# Altium project Learning_Platform.PrjPcb (part 4 of 4)

## Sheet Safety.SchDoc: <Project Name>
size A3; ApprovedBy: <Appr.>; Author: <Author>; CompanyName: Infineon Technologies AG; Engineer: <Rel.>; Organization: Infineon Technologies AG; Address1: IFAG DES S PS; Address2: Am Campeon 1-12  -  85579 Neubiberg  -  Germany; Address3: 85579 Neubiberg; Address4: Germany; DocumentNumber: 6; Revision: <Rev.>; SheetNumber: 6; SheetTotal: 9; Release: RC00; PageSetup: Record=PageOptions|CenterHorizontal=True|CenterVertical=True|PrintScale=1.01|XCorrection=1.00|YCorrection=1.00|PrintKind=0|BorderSize=5000000|LeftOffset=0|BottomOffset=0|Orientation=2|PaperLength=1000|PaperWidth=1000|Scale=100|PaperSource=7|PrintQuality=-4|MediaType=1|DitherType=10|PaperKind=A3|PrintScaleMode=1; Doc_ConfidentialStatus: <Doc_ConfidentialStatus>; Doc_Preliminary: <Doc_Preliminary>
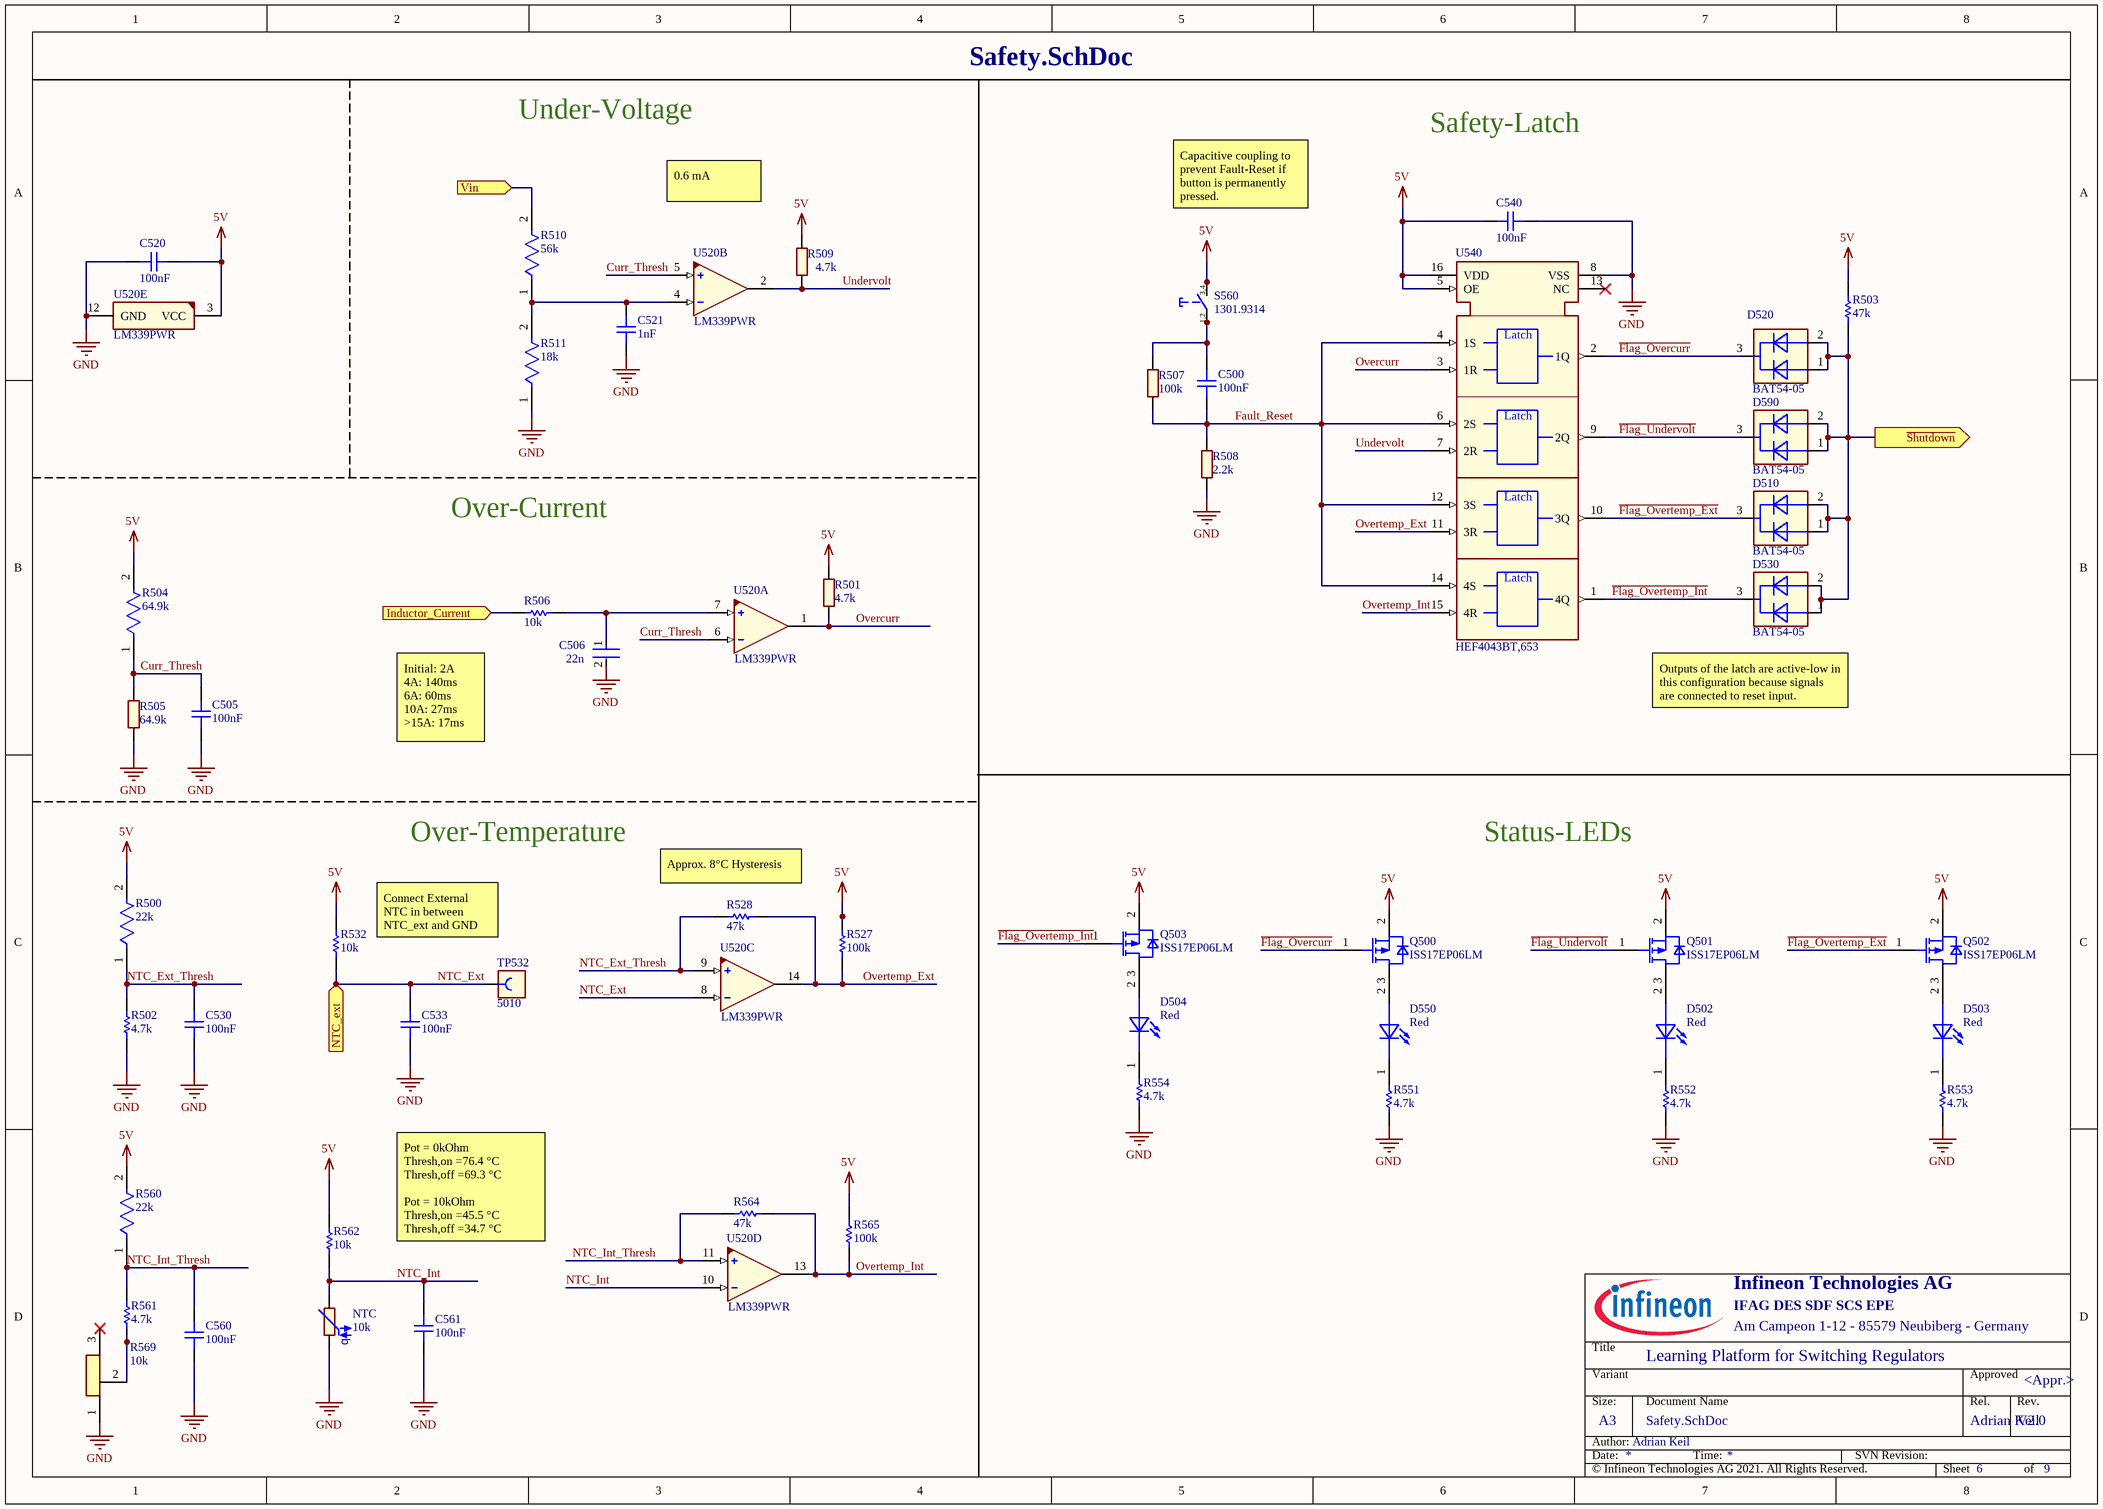
[diagram p4: Safety.SchDoc]

### Parts
C500  100nF  [CAPC3216X125N-0]
C505  100nF  [CAPC3216X125N-0]
C506  22n  [FP-GRM319-0_15-IPC_C]
C520  100nF  [CAPC3216X125N-0]
C521  1nF  [CAPC3216X95N]
C530  100nF  [CAPC3216X125N-0]
C533  100nF  [CAPC3216X125N-0]
C540  100nF  [CAPC3216X125N-0]
C560  100nF  [CAPC3216X125N-0]
C561  100nF  [CAPC3216X125N-0]
D502  Red  [LEDSC160X80X80-2N-1]
D503  Red  [LEDSC160X80X80-2N-1]
D504  Red  [LEDSC160X80X80-2N-1]
D510  BAT54-05  [SOT95P240X110-3N-1-V]
D520  BAT54-05  [SOT95P240X110-3N-1-V]
D530  BAT54-05  [SOT95P240X110-3N-1-V]
D550  Red  [LEDSC160X80X80-2N-1]
D590  BAT54-05  [SOT95P240X110-3N-1-V]
NTC  10k  [RESC1608X95N-1]
Q500  ISS17EP06LM  [SOT95P240X110-3N-1-V]
Q501  ISS17EP06LM  [SOT95P240X110-3N-1-V]
Q502  ISS17EP06LM  [SOT95P240X110-3N-1-V]
Q503  ISS17EP06LM  [SOT95P240X110-3N-1-V]
R500  22k  [FP-CRCW1206-e3-IPC_A]
R501  4.7k  [RESC3216X60N]
R502  4.7k  [RESC3216X60X45ML15T20]
R503  47k  [RESC3216X60X45LL10T20]
R504  64.9k  [FP-CRCW1206-e3-IPC_C]
R505  64.9k  [RESC3216X60N]
R506  10k  [RESC3116X65X50NL20T20]
R507  100k  [RESC3216X60N]
R508  2.2k  [RESC3216X60N]
R509  4.7k  [RESC3216X60N]
R510  56k  [FP-CRCW1206-e3-IPC_C]
R511  18k  [FP-CRCW1206-e3-IPC_C]
R527  100k  [RESC3216X60X45NL10T20]
R528  47k  [RESC3216X60X45LL10T20]
R532  10k  [RESC3116X65X50NL20T20]
R551  4.7k  [RESC3216X60X45ML15T20]
R552  4.7k  [RESC3216X60X45ML15T20]
R553  4.7k  [RESC3216X60X45ML15T20]
R554  4.7k  [RESC3216X60X45ML15T20]
R560  22k  [FP-CRCW1206-e3-IPC_A]
R561  4.7k  [RESC3216X60X45ML15T20]
R562  10k  [RESC3116X65X50NL20T20]
R564  47k  [RESC3216X60X45LL10T20]
R565  100k  [RESC3216X60X45NL10T20]
R569  10k  [3361P1103GLF]
S560  1301.9314  [SW-SMD-1301.9314]
TP532  5010  [CON-THT-TP-5010]
U520  LM339PWR  [SOP65P640X120-14N-1]  (parts A,B,C,D,E of 5)
U540  HEF4043BT,653  [SOIC127P600X175-16N-6]

### Ports
Inductor_Current (in), NTC_ext (in), Vin (in), ~{Shutdown} (out)

### Nets
5V: C520.1 C540.2 Q500.2(SOURCE) Q501.2(SOURCE) Q502.2(SOURCE) Q503.2(SOURCE) R500.2 R501.2 R503.2 R504.2 R509.2 R527.2 R532.2 R560.2 R562.2 R565.2 S560.3 S560.4 U520.3(VCC) U540.5(OE) U540.16(VDD)
GND: C505.1 C506.2 C520.2 C521.1 C530.1 C533.1 C540.1 C560.1 C561.1 NTC.1 R502.1 R505.1 R508.2 R511.1 R551.1 R552.1 R553.1 R554.1 R569.1(CCW) U520.12(GND) U540.8(VSS)
~{Flag_Overcurr}: D520.3(CATHODE) Q500.1(GATE) U540.2(1Q)
~{Flag_Overtemp_Ext}: D510.3(CATHODE) Q502.1(GATE) U540.10(3Q)
~{Flag_Overtemp_Int}: D530.3(CATHODE) Q503.1(GATE) U540.1(4Q)
~{Flag_Undervolt}: D590.3(CATHODE) Q501.1(GATE) U540.9(2Q)
~{Shutdown}: D510.1(ANODE_1) D510.2(ANODE_2) D520.1(ANODE_1) D520.2(ANODE_2) D530.1(ANODE_1) D530.2(ANODE_2) D590.1(ANODE_1) D590.2(ANODE_2) R503.1 ; port ~{Shutdown}
Curr_Thresh: C505.2 R504.1 R505.2 U520.5(2IN_P) U520.6(1IN_N)
Fault_Reset: C500.2 R507.1 R508.1 U540.4(1S) U540.6(2S) U540.12(3S) U540.14(4S)
Inductor_Current: R506.1 ; port Inductor_Current
NTC_ext: C533.2 R532.1 TP532.1 U520.8(3IN_N) ; port NTC_ext
NTC_Ext_Thresh: C530.2 R500.1 R502.2 R528.1 U520.9(3IN_P)
NTC_Int: C561.2 NTC.2 R562.1 U520.10(4IN_N)
NTC_Int_Thresh: C560.2 R560.1 R561.2 R564.1 U520.11(4IN_P)
Overcurr: R501.1 U520.1(1OUT) U540.3(1R)
Overtemp_Ext: R527.1 R528.2 U520.14(3OUT) U540.11(3R)
Overtemp_Int: R564.2 R565.1 U520.13(4OUT) U540.15(4R)
Undervolt: R509.1 U520.2(2OUT) U540.7(2R)
Vin: R510.2 ; port Vin
NetC500_1: C500.1 R507.2 S560.1 S560.2
NetC506_1: C506.1 R506.2 U520.7(1IN_P)
NetC521_2: C521.2 R510.1 R511.2 U520.4(2IN_N)
NetD502_1: D502.1(Cathode) R552.2
NetD502_2: D502.2(Anode) Q501.3(DRAIN)
NetD503_1: D503.1(Cathode) R553.2
NetD503_2: D503.2(Anode) Q502.3(DRAIN)
NetD504_1: D504.1(Cathode) R554.2
NetD504_2: D504.2(Anode) Q503.3(DRAIN)
NetD550_1: D550.1(Cathode) R551.2
NetD550_2: D550.2(Anode) Q500.3(DRAIN)
NetR561_1: R561.1 R569.2(WIPER_)

Not connected (* = marked no-connect by the designer): R569 3(CW)*; U540 13(NC)*

### Notes on the sheet
- Under-Voltage
- Safety-Latch
- 0.6 mA
- Capacitive coupling to prevent Fault-Reset if button is permanently pressed.
- Over-Current
- (near D530) Outputs of the latch are active-low in this configuration because signals  are connected to reset input.
- Initial: 2A
  4A: 140ms
  6A: 60ms
  10A: 27ms
  >15A: 17ms
- Over-Temperature
- Status-LEDs
- (near R528) Approx. 8°C Hysteresis
- Connect External NTC in between NTC_ext and GND
- Pot = 0kOhm
  Thresh,on =76.4 °C
  Thresh,off =69.3 °C
  Pot = 10kOhm
  Thresh,on =45.5 °C
  Thresh,off =34.7 °C
- Title
- Variant
- Approved
- Date:
- Author:
- Size:
- A3
- Document Name
- Time:
- SVN Revision:
- Rel.
- Rev.
- Sheet
- of
- (in symbol 380147) 3,4; 1,2
- (in symbol 466242) q
- (in symbol 648079) Latch

### Library data of the parts
C500 C505 C520 C530 C533 C540 C560 C561 = 282874: CAP / CERA / 100nF / 50V / 10% / X7R (EIA) / -55°C to 125°C / 1206(3216) / SMD / -; Multiple Parts: No; Legacy PartNumber: CAP01005660; Manufacturer: MuRata; Manufacturer Order Number: GRM31MR71H104KA01; Symbol Type: Capacitor; Single; Standard; 2 Pins; Alternate View: Yes; Article Number: 282874; Version Number: V01; Combined Parameters: TC:X7R (EIA);Tol.:-10%/+10%;Vdc:50V; QuickPick: 100nF / 50V / 10% / X7R (EIA) / 1206 (3216); Type: Standard; Style: Single; Package Metric: 3216; Package Imperial: 1206; ComponentStatus: Released; PLMStatus: Obsolete; Legacy DeviceID: CAP01005660; Part Type: Capacitor; Value: 100nF; Tolerance Neg: 10%; Tolerance Pos: 10%; Application: Standard; Technology: Ceramic; Temperature min: -55; Temperature max: 125; Temperature Range: Military; ROHS Compliant: Y; Automotive Qualified: No; PackageReference: 1206 (3216); ComponentLink1Description: Vendor WebSite; ComponentLink1URL: http://www.murata.com/; ComponentLink2Description: Datasheet; ComponentLink2URL: http://webnetprod.muc.infineon.com/PCBPortal_Prod/WorkFlows/AltiumComponent/StandardDocumentation?Versionid=282875; Supplier 1: Farnell; Supplier 2: DigiKey; Supplier 3: Mouser; Second Source allowed: Yes; Voltage DC (max): 50V; Package Description: Capacitor,non-polarized,Chip;3.20mm L X 1.60mm W X 1.25mm H
C506 = CMP-1037-03764-2: Chip Multilayer Ceramic Capacitors for General Purpose, 1206, 22000pF, C0G, 30ppm/°C, 5%, 50V; MPN: GRM3195C1H223JA01D; Value: 22nF; Insulation Resistance: 10GR; Dielectric: C0G; Dielectric Material: Ceramic; Termination: SMD/SMT; Voltage Rating: 50V; Width: 0.063inch; Number of Pins: 2; Mount: Surface Mount; REACH SVHC: No SVHC; Series: GRM; Voltage: 50V; Length: 3.2mm; Thickness: 0.037inch; Radiation Hardening: No; Case/Package: 1206; Case Code (Metric): 3216; Min Operating Temperature: -55°C; Package Quantity: 4000; Lead Free: Lead Free; Voltage Rating (DC): 50V; Height: 0.85mm; Depth: 1.6mm; Max Operating Temperature: 125°C; Packaging: Tape and Reel; Tolerance: 5%; Construction: Flat; Material: Ceramic; Temperature Coefficient: 30ppm/°C; Case Code (Imperial): 1206; LCSC Part #: C97929
C521 = 280698: CAP / CERA / 1nF / 50V / 10% / X7R (EIA) / -55°C to 125°C / 1206(3216) / SMD / -; Multiple Parts: No; Legacy PartNumber: CAP01005183; Manufacturer: MuRata; Manufacturer Order Number: GRM319R71H102KA01; Symbol Type: Capacitor; Single; Standard; 2 Pins; Alternate View: Yes; Article Number: 280698; Version Number: V01; Combined Parameters: TC:X7R (EIA);Tol.:-10%/+10%;Vdc:50V; QuickPick: 1nF / 50V / 10% / X7R (EIA) / 1206 (3216); Type: Standard; Style: Single; Package Metric: 3216; Package Imperial: 1206; ComponentStatus: Released; PLMStatus: Obsolete; Legacy DeviceID: CAP01005183; Part Type: Capacitor; Value: 1nF; Tolerance Neg: 10%; Tolerance Pos: 10%; Application: Standard; Technology: Ceramic; Temperature min: -55; Temperature max: 125; Temperature Range: Military; ROHS Compliant: Y; Automotive Qualified: No; PackageReference: 1206 (3216); ComponentLink1Description: Vendor WebSite; ComponentLink1URL: http://www.murata.com/; ComponentLink2Description: Datasheet; ComponentLink2URL: http://webnetprod.muc.infineon.com/PCBPortal_Prod/WorkFlows/AltiumComponent/StandardDocumentation?Versionid=280699; Supplier 1: Farnell; Supplier 2: DigiKey; Supplier 3: Mouser; Second Source allowed: Yes; Voltage DC (max): 50V; Package Description: Capacitor,non-polarized,Chip;3.20mm L X 1.60mm W X 0.95mm H
D502-D504 D550 = 625459: WL-SMCW SMT Mono-color Chip LED Waterclear, Red,630nm; Manufacturer: Wurth Elektronik; Manufacturer Order Number: 150060RS75000; Symbol Type: Standard LED Symbol, 1 Cathode, 2 Anode; Article Number: 625459; Version Number: V01; Combined Parameters: Vf:2.4V;If:30mA;Ur:5V;Ir:10uA;Pmax:72mW; QuickPick: LED / 1608 (0603); Style: Single; Automotive Qualified: No; ComponentStatus: Released; PLMStatus: Active; Second Source allowed: Yes; Voltage DC (max): na; Part Type: Diode; Value: Red; Type: LED; Application: Standard; Temperature min: -40; Temperature max: 85; Temperature Range: Industrial; ROHS Compliant: Y; PackageReference: 1608 (0603); ComponentLink1Description: Vendor WebSite; ComponentLink1URL: http://www.we-online.com; ComponentLink2Description: Datasheet; ComponentLink2URL: http://webnetprod.muc.infineon.com/PCBPortal_Prod/WorkFlows/AltiumComponent/StandardDocumentation?Versionid=625460; Supplier 1: Farnell; Supplier Part Number 1: 2322071; Supplier 2: DigiKey; Supplier Part Number 2: 732-4978-1-ND; Supplier 3: Mouser; Supplier Part Number 3: 710-150060RS75000; Package Description: LED,Side Concave; 2 pin,1.60mm W X 0.80mm L X 0.80mm H
D510 = 430837: Silicon Schottky Diode, LS(nH) 1.8, VR 30V; Legacy PartNumber: IFX01401370; Manufacturer: Infineon Technologies; MPN: BAT5405E6327HTSA1; Symbol type: Dual Diode Symbol 3 Pins, 1 Anode, 2 Anode, 3 Cathode; Article Number: 430837; Version Number: V01; Combined Parameters: Vf:800mV;If:200mA;Ur:30V;Ir:2uA;Pmax:230mW; QuickPick: Schottky Diode / PG-SOT23-3-11; Style: Dual; Automotive Qualified: AEC Q101; ComponentStatus: Released; PLMStatus: Active; Second Source allowed: Yes; Voltage DC (max): na; Legacy DeviceID: IFX01401370; Part Type: Diode; Manufacturer Order Number: BAT54-05; Value: BAT54-05; Type: Schottky Diode; Application: Standard; Temperature min: 0; Temperature max: 150; Temperature Range: Military; ROHS Compliant: Y; PackageReference: PG-SOT23-3-11; ComponentLink1Description: Vendor WebSite; ComponentLink1URL: https://www.infineon.com/; ComponentLink2Description: Datasheet; ComponentLink2URL: http://webnetprod.muc.infineon.com/PCBPortal_Prod/WorkFlows/AltiumComponent/StandardDocumentation?Versionid=430838; Supplier 1: Farnell; Supplier Part Number 1: 2725759; Supplier 2: DigiKey; Supplier Part Number 2: BAT5405E6327HTSA1TR-ND; Supplier 3: Mouser; Supplier Part Number 3: 726-BAT5405E6327HTSA; Package Description: SOT,0.95mm pitch;3 pin,1.30mm W X 2.90mm L X 1.10mm H body; LCSC Part #: C533646
D520 D530 D590 = 430837: Silicon Schottky Diode, LS(nH) 1.8, VR 30V; Legacy PartNumber: IFX01401370; Manufacturer: Infineon Technologies; Symbol type: Dual Diode Symbol 3 Pins, 1 Anode, 2 Anode, 3 Cathode; Article Number: 430837; Version Number: V01; Combined Parameters: Vf:800mV;If:200mA;Ur:30V;Ir:2uA;Pmax:230mW; QuickPick: Schottky Diode / PG-SOT23-3-11; Style: Dual; Automotive Qualified: AEC Q101; ComponentStatus: Released; PLMStatus: Active; Second Source allowed: Yes; Voltage DC (max): na; Legacy DeviceID: IFX01401370; Part Type: Diode; Manufacturer Order Number: BAT54-05; Value: BAT54-05; Type: Schottky Diode; Application: Standard; Temperature min: 0; Temperature max: 150; Temperature Range: Military; ROHS Compliant: Y; PackageReference: PG-SOT23-3-11; ComponentLink1Description: Vendor WebSite; ComponentLink1URL: https://www.infineon.com/; ComponentLink2Description: Datasheet; ComponentLink2URL: http://webnetprod.muc.infineon.com/PCBPortal_Prod/WorkFlows/AltiumComponent/StandardDocumentation?Versionid=430838; Supplier 1: Farnell; Supplier Part Number 1: 2725759; Supplier 2: DigiKey; Supplier Part Number 2: BAT5405E6327HTSA1TR-ND; Supplier 3: Mouser; Supplier Part Number 3: 726-BAT5405E6327HTSA; Package Description: SOT,0.95mm pitch;3 pin,1.30mm W X 2.90mm L X 1.10mm H body
NTC = 466242: RES / NTC / 10k / 100mW / 1% / - / -40°C to 125°C / 0603(1608) / SMD / -; Multiple Parts: No; Legacy PartNumber: RES01806219; Manufacturer: MuRata; Manufacturer Order Number: NCP18XH103F03RB; Symbol Type: Resistor; Single; Negative Temperature Coefficient; 2 Pins; Alternate View: Yes; Article Number: 466242; Version Number: V01; Combined Parameters: TCR:-;Tol.:-1%/+1%;Vdc:-;Idc:-;P:100mW; QuickPick: 10k / 1% / 0.1 / 0603; Style: Single; Package Metric: 1608; Package Imperial: 0603; ComponentStatus: Released; PLMStatus: Active; Legacy DeviceID: RES01806219; Part Type: Resistor; Value: NTC; Tolerance Neg: 1%; Tolerance Pos: 1%; Type: Negative Temperature Coefficient (NTC); Temperature min: -40; Temperature max: 125; Temperature Range: Automotive; ROHS Compliant: Y; Automotive Qualified: No; PackageReference: 0603; ComponentLink1Description: Vendor WebSite; ComponentLink1URL: http://www.murata.com/; ComponentLink2Description: Datasheet; ComponentLink2URL: http://webnetprod.muc.infineon.com/PCBPortal_Prod/WorkFlows/AltiumComponent/StandardDocumentation?Versionid=466243; Supplier 1: Farnell; Supplier Part Number 1: 2456122RL; Supplier 2: DigiKey; Supplier Part Number 2: 490-4800-2-ND; Supplier 3: Mouser; Supplier Part Number 3: 81-NCP18XH103F03RB; Second Source allowed: Yes; Package Description: Resistor,Chip;1.60mm L X 0.80mm W X 0.95mm H; MPN: NCP18XH103F03RB
Q500-Q503 = 615536: OptiMOSTM Small Signal Transistor, -60 V; Manufacturer: Infineon Technologies; Symbol Type: Insulated-Gate Field-Effect Transistor (IGFET), P-Channel, Enhancement,  Body Diode, Pin 1 Gate, 2 Source, 3 Drain, 3 Pins; Article Number: 615536; Version Number: V01; Legacy DeviceID: IFX_ISS17EP06LM; Combined Parameters: P-Channel Enhancement;Uds:-60V;Id:-300mA;Rds:1.7R;P:360mW; QuickPick: P-Channel Enhancement / 360mW / -300mA / -60V / PG-SOT23-3-5; Type: P-Channel Enhancement; Style: Single; Automotive Qualified: No; ComponentStatus: Released; PLMStatus: Active; Second Source allowed: Yes; Voltage DC (max): na; Part Type: Transistor FET; Manufacturer Order Number: ISS17EP06LM; Value: ISS17EP06LM; Application: Small Signal; Temperature min: -55; Temperature max: 150; Temperature Range: Military; ROHS Compliant: Y; PackageReference: PG-SOT23-3-5; ComponentLink1Description: Vendor WebSite; ComponentLink1URL: https://www.infineon.com/; ComponentLink2Description: Datasheet; ComponentLink2URL: http://webnetprod.muc.infineon.com/PCBPortal_Prod/WorkFlows/AltiumComponent/StandardDocumentation?Versionid=615537; Supplier 1: Farnell; Supplier Part Number 1: 3267800; Supplier 2: DigiKey; Supplier Part Number 2: 448-ISS17EP06LMXTSA1CT-ND; Supplier 3: Mouser; Supplier Part Number 3: 726-ISS17EP06LMXTSA1; Package Description: SOT,0.95mm,pitch;3 pin,1.30mm W X 2.90mm L X 1.10mm H body
R500 R560 = CMP-2003-01962-2: RES Thick Film, 22kΩ, 1%, 0.25W, 100ppm/°C, 1206; Voltage Rating (DC): 200V; Max Power Dissipation: 250mW; Lead Free: Lead Free; Length: 3.2mm; Case Code (Imperial): 1206; Max Operating Temperature: 155°C; Value: 22k; Packaging: Tape and Reel; Composition: Thick Film; Temperature Coefficient: 100ppm/°C; Contact Plating: Tin; Number of Terminations: 2; Case Code (Metric): 3216; Tolerance: 1%; Weight: 0.000353oz; Features: Automotive AEC-Q200; Min Operating Temperature: -55°C; Width: 0.063inch; Package Quantity: 10; Case/Package: 1206; Termination: SMD/SMT; Military Standard: Not; Depth: 1.6mm; Voltage Rating: 200V; Radiation Hardening: No; Power Rating: 250mW; Height: 0.55mm
R501 R509 = 353992: RES / STD / 4.7k / 250mW / 1% / 100ppm/K / -55°C to 155°C / 1206(3216) / SMD / -; Multiple Parts: No; Legacy PartNumber: RES01802819; Manufacturer: Vishay; Manufacturer Order Number: CRCW12064K70FK; Symbol Type: Resistor; Single; Standard; 2 Pins; Alternate View: Yes; Article Number: 353992; Version Number: V01; Combined Parameters: TCR:100ppm/K;Tol.:-1%/+1%;Vdc:200V;Idc:-;P:250mW; QuickPick: 4.7k / 1% / 0.25 / 1206 (3216); Style: Single; Automotive Qualified: AEC Q200; Package Metric: 3216; Package Imperial: 1206; ComponentStatus: Released; PLMStatus: Active; Voltage DC (max): 200V; Legacy DeviceID: RES01802819; Part Type: Resistor; Value: 4.7k; Tolerance Neg: 1%; Tolerance Pos: 1%; Type: Standard; Technology: Thick Film; Temperature min: -55; Temperature max: 155; Temperature Range: Military; ROHS Compliant: Y; PackageReference: 1206 (3216); ComponentLink1Description: Vendor WebSite; ComponentLink1URL: http://www.vishay.com; ComponentLink2Description: Datasheet; ComponentLink2URL: http://webnetprod.muc.infineon.com/PCBPortal_Prod/WorkFlows/AltiumComponent/StandardDocumentation?Versionid=353993; Supplier 1: Farnell; Supplier 2: DigiKey; Supplier 3: Mouser; Second Source allowed: Yes
R502 = CMP-2100-03618-1: Chip Resistor, 4.7 KOhm, +/- 1%, 0.25 W, -55 to 155 degC, 1206 (3216 Metric), RoHS, Tape and Reel; Manufacturer: Vishay Semiconductor; MPN: CRCW12064K70FKEA; Power Rating: 250mW; Voltage Rating: 200V; Temperature Coefficient: 100ppm/degreesC; Package Quantity: 10; Composition: ThickFilm; REACH SVHC: Unknown; Mount: SurfaceMount; Max Operating Temperature: 155degC; Length: 3.2mm; Number of Terminations: 2; Case Code (Metric): 3216; Military Standard: Not; Width: 1.6mm; Datasheet Version: 41061.0; Max Power Dissipation: 250mW; Datasheet URL: http://www.vishay.com/docs/20035/dcrcwe3.pdf; Contact Plating: Tin; Case/Package: 1206; Height: 0.55mm; Package Reference: 1206.0; Lead Free: LeadFree; Weight: 0.000353oz; Package Description: 2-Pin Surface Mount Device, Body 3.15 x 1.6 mm; Min Operating Temperature: -55degC; Value: 4.7KOhm; Packaging: TapeandReel; Depth: 1.6mm; Tolerance: 1%; RoHSCompliant: true; Termination: SMD/SMT; Case Code (Imperial): 1206; Voltage Rating (DC): 200V; Radiation Hardening: No; Manufacturer URL: http://www.vishay.com/; LCSC Part #: C137262
R503 R528 R564 = CMP-2003-02213-1: Part Number: CRCW120647K0FKEA; Manufacturer: Vishay Dale; Value: 47k
R504 = CMP-2003-02331-2: RES Thick Film, 64.9kΩ, 1%, 0.25W, 100ppm/°C, 1206; MPN: CRCW120664K9FKEA; Voltage Rating: 200V; Max Power Dissipation: 250mW; Max Operating Temperature: 155°C; Military Standard: Not; Value: 64.9k; Composition: Thick Film; Temperature Coefficient: 100ppm/°C; Contact Plating: Tin; Packaging: Tape and Reel; Case Code (Imperial): 1206; Weight: 0.000353oz; Height: 0.024inch; Number of Pins: 2; Length: 3.2mm; Radiation Hardening: No; Voltage Rating (DC): 200V; Case/Package: 1206; Termination: SMD/SMT; Tolerance: 1%; Min Operating Temperature: -55°C; Number of Terminations: 2; Width: 0.063inch; Depth: 1.6mm; Power Rating: 250mW; Case Code (Metric): 3216; Features: Automotive AEC-Q200; Lead Free: Lead Free; Package Quantity: 10; LCSC Part #: C274045
R505 = 354647: RES / STD / 64.9k / 250mW / 1% / 100ppm/K / -55°C to 155°C / 1206(3216) / SMD / -; Multiple Parts: No; Legacy PartNumber: RES01802950; Manufacturer: Vishay; Manufacturer Order Number: CRCW120664K9FK; Symbol Type: Resistor; Single; Standard; 2 Pins; Alternate View: Yes; Article Number: 354647; Version Number: V01; Combined Parameters: TCR:100ppm/K;Tol.:-1%/+1%;Vdc:200V;Idc:-;P:250mW; QuickPick: 64.9k / 1% / 0.25 / 1206 (3216); Style: Single; Automotive Qualified: AEC Q200; Package Metric: 3216; Package Imperial: 1206; ComponentStatus: Released; PLMStatus: Active; Voltage DC (max): 200V; Legacy DeviceID: RES01802950; Part Type: Resistor; Value: 64.9k; Tolerance Neg: 1%; Tolerance Pos: 1%; Type: Standard; Technology: Thick Film; Temperature min: -55; Temperature max: 155; Temperature Range: Military; ROHS Compliant: Y; PackageReference: 1206 (3216); ComponentLink1Description: Vendor WebSite; ComponentLink1URL: http://www.vishay.com; ComponentLink2Description: Datasheet; ComponentLink2URL: http://webnetprod.muc.infineon.com/PCBPortal_Prod/WorkFlows/AltiumComponent/StandardDocumentation?Versionid=354648; Supplier 1: Farnell; Supplier 2: DigiKey; Supplier 3: Mouser; Second Source allowed: Yes
R506 R532 R562 = CMP-2003-04883-1: Part Number: CRCW120610K0FKEAHP; Manufacturer: Vishay Dale; Value: 10k
  R506: LCSC Part #: C313977; MPN: CRCW120610K0FKEAHP
R507 = 354752: RES / STD / 100k / 250mW / 1% / 100ppm/K / -55°C to 155°C / 1206(3216) / SMD / -; Multiple Parts: No; Legacy PartNumber: RES01802971; Manufacturer: Vishay; Manufacturer Order Number: CRCW1206100KFK; Symbol Type: Resistor; Single; Standard; 2 Pins; Alternate View: Yes; Article Number: 354752; Version Number: V01; Combined Parameters: TCR:100ppm/K;Tol.:-1%/+1%;Vdc:200V;Idc:-;P:250mW; QuickPick: 100k / 1% / 0.25 / 1206 (3216); Style: Single; Automotive Qualified: AEC Q200; Package Metric: 3216; Package Imperial: 1206; ComponentStatus: Released; PLMStatus: Active; Voltage DC (max): 200V; Legacy DeviceID: RES01802971; Part Type: Resistor; Value: 100k; Tolerance Neg: 1%; Tolerance Pos: 1%; Type: Standard; Technology: Thick Film; Temperature min: -55; Temperature max: 155; Temperature Range: Military; ROHS Compliant: Y; PackageReference: 1206 (3216); ComponentLink1Description: Vendor WebSite; ComponentLink1URL: http://www.vishay.com; ComponentLink2Description: Datasheet; ComponentLink2URL: http://webnetprod.muc.infineon.com/PCBPortal_Prod/WorkFlows/AltiumComponent/StandardDocumentation?Versionid=354753; Supplier 1: Farnell; Supplier 2: DigiKey; Supplier 3: Mouser; Second Source allowed: Yes
R508 = 353792: RES / STD / 2.2k / 250mW / 1% / 100ppm/K / -55°C to 155°C / 1206(3216) / SMD / -; Multiple Parts: No; Legacy PartNumber: RES01802779; Manufacturer: Vishay; Manufacturer Order Number: CRCW12062K20FK; MPN: CRCW12062K20FKEA; Symbol Type: Resistor; Single; Standard; 2 Pins; Alternate View: Yes; Article Number: 353792; Version Number: V01; Combined Parameters: TCR:100ppm/K;Tol.:-1%/+1%;Vdc:200V;Idc:-;P:250mW; QuickPick: 2.2k / 1% / 0.25 / 1206 (3216); Style: Single; Automotive Qualified: AEC Q200; Package Metric: 3216; Package Imperial: 1206; ComponentStatus: Released; PLMStatus: Active; Voltage DC (max): 200V; Legacy DeviceID: RES01802779; Part Type: Resistor; Value: 2.2k; Tolerance Neg: 1%; Tolerance Pos: 1%; Type: Standard; Technology: Thick Film; Temperature min: -55; Temperature max: 155; Temperature Range: Military; ROHS Compliant: Y; PackageReference: 1206 (3216); ComponentLink1Description: Vendor WebSite; ComponentLink1URL: http://www.vishay.com; ComponentLink2Description: Datasheet; ComponentLink2URL: http://webnetprod.muc.infineon.com/PCBPortal_Prod/WorkFlows/AltiumComponent/StandardDocumentation?Versionid=353793; Supplier 1: Farnell; Supplier 2: DigiKey; Supplier 3: Mouser; Second Source allowed: Yes; LCSC Part #: C204754
R510 = CMP-2003-02282-2: RES Thick Film, 56kΩ, 1%, 0.25W, 100ppm/°C, 1206; MPN: CRCW120656K0FKEA; Voltage Rating (DC): 200V; Resistance: 56kR; Power Rating: 250mW; Packaging: Tape and Reel; Case/Package: 1206; Lead Free: Lead Free; Height: 0.55mm; Max Operating Temperature: 155°C; Case Code (Metric): 3216; Tolerance: 1%; Contact Plating: Tin; Min Operating Temperature: -55°C; Termination: SMD/SMT; Voltage Rating: 200V; Number of Pins: 2; Radiation Hardening: No; Military Standard: Not; Depth: 1.6mm; Composition: Thick Film; Number of Terminations: 2; Package Quantity: 10; Temperature Coefficient: 100ppm/°C; Width: 0.063inch; Case Code (Imperial): 1206; Weight: 0.000353oz; Length: 3.2mm; Max Power Dissipation: 250mW; Features: Automotive AEC-Q200; Value: 56k; LCSC Part #: C137251
R511 = CMP-2003-01854-2: RES Thick Film, 18kΩ, 1%, 0.25W, 100ppm/°C, 1206; Max Power Dissipation: 250mW; Voltage Rating: 200V; Resistance: 18kR; Radiation Hardening: No; Case Code (Imperial): 1206; Case/Package: 1206; Lead Free: Lead Free; Number of Terminations: 2; Case Code (Metric): 3216; Number of Pins: 2; Power Rating: 250mW; Length: 3.2mm; Width: 0.063inch; Features: Automotive AEC-Q200; Max Operating Temperature: 155°C; Tolerance: 1%; Termination: SMD/SMT; Military Standard: Not; Composition: Thick Film; Min Operating Temperature: -55°C; Temperature Coefficient: 100ppm/°C; Package Quantity: 10; Weight: 0.000353oz; Voltage Rating (DC): 200V; Depth: 1.6mm; Contact Plating: Tin; Height: 0.55mm; Packaging: Tape and Reel; Value: 18k
R527 R565 = CMP-1014-00736-2: Part Number: CRCW1206100KFKEA; Manufacturer: Vishay Dale; Value: 100k
R551-R554 R561 = CMP-2100-03618-1: Chip Resistor, 4.7 KOhm, +/- 1%, 0.25 W, -55 to 155 degC, 1206 (3216 Metric), RoHS, Tape and Reel; Manufacturer: Vishay Semiconductor; Power Rating: 250mW; Voltage Rating: 200V; Temperature Coefficient: 100ppm/degreesC; Package Quantity: 10; Composition: ThickFilm; REACH SVHC: Unknown; Mount: SurfaceMount; Max Operating Temperature: 155degC; Length: 3.2mm; Number of Terminations: 2; Case Code (Metric): 3216; Military Standard: Not; Width: 1.6mm; Datasheet Version: 41061.0; Max Power Dissipation: 250mW; Datasheet URL: http://www.vishay.com/docs/20035/dcrcwe3.pdf; Contact Plating: Tin; Case/Package: 1206; Height: 0.55mm; Package Reference: 1206.0; Lead Free: LeadFree; Weight: 0.000353oz; Package Description: 2-Pin Surface Mount Device, Body 3.15 x 1.6 mm; Min Operating Temperature: -55degC; Value: 4.7KOhm; Packaging: TapeandReel; Depth: 1.6mm; Tolerance: 1%; RoHSCompliant: true; Termination: SMD/SMT; Case Code (Imperial): 1206; Voltage Rating (DC): 200V; Radiation Hardening: No; Manufacturer URL: http://www.vishay.com/
R569 = 3361P-1-103GLF: Variable Resistor; Manufacturer_Name: Bourns; Datasheet Link: https://www.bourns.com/docs/Product-Datasheets/3361.pdf; Height: 5.84mm; Manufacturer_Part_Number: 3361P-1-103GLF; Mouser Part Number: 652-3361P-1-103GLF; Mouser Price/Stock: https://www.mouser.co.uk/ProductDetail/Bourns/3361P-1-103GLF?qs=fqIB%2FsSTfTYiaQC8SLZfNQ%3D%3D; Arrow Part Number: 3361P-1-103GLF; Arrow Price/Stock: https://www.arrow.com/en/products/3361p-1-103glf/bourns?region=nac; Value: 3361P-1-103GLF; LCSC Part #: C840679; MPN: 3361P-1-103GLF
S560 = 380147: Pushbutton Tactile Switch, Single Pole Single Throw, 4 Pins; Legacy PartNumber: CON01500305; Manufacturer: Schurter; Symbol type: Tactile Switch, Spring Return, Single Pole Single Throw - Normally Open, 4 Pins; Article Number: 380147; Version Number: V01; Legacy DeviceID: SCH_1301.9314; ComponentStatus: Released; PLMStatus: Active; Second Source allowed: Yes; Voltage DC (max): na; Part Type: Electro Mechanic; Manufacturer Order Number: 1301.9314; Value: 1301.9314; Temperature min: -20; Temperature max: 70; Temperature Range: Commercial; ROHS Compliant: Y; ComponentLink1Description: Vendor WebSite; ComponentLink1URL: http://www.schurter.com.sg/; ComponentLink2Description: Datasheet; ComponentLink2URL: http://webnetprod.muc.infineon.com/PCBPortal_Prod/WorkFlows/AltiumComponent/StandardDocumentation?Versionid=380148; Supplier 1: Farnell; Supplier Part Number 1: 1217763; Supplier 2: DigiKey; Supplier Part Number 2: 1301.9314-ND; Supplier 3: Mouser; Supplier Part Number 3: 693-1301.9314; Package Description: SMD Switch, 6.00mm L X 6.00mm W X 4.3mm H body
TP532 = 382400: PC Test Point-Multipurpose THT, Red; Multiple Parts: No; Legacy PartNumber: CON01500529; Manufacturer: Keystone Electronics Corp.; Symbol Type: Connector, 1 Lead, Female; Alternate View: Yes; Article Number: 382400; Version Number: V01; Legacy DeviceID: KEY_5010; Combined Parameters: Board-to-Cable None (onboard);1x1;Mounting:THT;Orient:0° (vertical);Shielded:No; QuickPick: 0° (vertical) / Board-to-Cable; Style: Not Applicable; ComponentStatus: Released; PLMStatus: Active; Voltage DC (max): na; Part Type: Connector; Manufacturer Order Number: 5010; Value: 5010; Type: Board-to-Cable; Application: Test; Temperature min: 0; Temperature max: 0; Temperature Range: Military; ROHS Compliant: Y; Automotive Qualified: No; ComponentLink1Description: Vendor WebSite; ComponentLink1URL: http://www.keyelco.com/; ComponentLink2Description: Datasheet; ComponentLink2URL: http://webnetprod.muc.infineon.com/PCBPortal_Prod/WorkFlows/AltiumComponent/StandardDocumentation?Versionid=382401; Supplier 1: Farnell; Supplier Part Number 1: 2301288; Supplier 2: DigiKey; Supplier Part Number 2: 36-5010-ND; Supplier 3: Mouser; Supplier Part Number 3: 534-5010; Second Source allowed: Yes; Package Description: Test Point, 1.78 mm Lead Width, Round, 3.17 mm Dia X 8.28 mm H body
U520 = 409035: Quad Differential Comparator; Legacy PartNumber: IC02600564; Manufacturer: Texas Instruments; Alternate View: Yes; Article Number: 409035; Version Number: V01; Legacy DeviceID: TI_LM339; Combined Parameters: Res.:-;Fmax:-; QuickPick: TSSOP-14 (PW); Automotive Qualified: No; ComponentStatus: Released; PLMStatus: Active; Voltage DC (max): na; Symbol Type: Quad Differential Comparator; Part Type: Analog Parts; Manufacturer Order Number: LM339PWR; Value: LM339PWR; Temperature min: 0; Temperature max: 0; Temperature Range: Military; PackageReference: TSSOP-14 (PW); ComponentLink1Description: Vendor WebSite; ComponentLink1URL: http://www.ti.com; ComponentLink2Description: Datasheet; ComponentLink2URL: http://webnetprod.muc.infineon.com/PCBPortal_Prod/WorkFlows/AltiumComponent/StandardDocumentation?Versionid=409036; Supplier 1: Farnell; Supplier Part Number 1: 2436009; Supplier 2: DigiKey; Supplier Part Number 2: 296-6607-2-ND; Supplier 3: Mouser; Supplier Part Number 3: 595-LM339PWR; Second Source allowed: Yes; MPN: LM339PWR
U540 = 648079: Quad R/S latch with 3-state outputs; Multiple Parts: No; Manufacturer: Nexperia; Article Number: 648079; Version Number: V00; Legacy DeviceID: NEX_HEF4043BT,653; Combined Parameters: - Digital;Vdc min/max:3V/15V;Iout:2.4mA;Fmax:-; QuickPick: SO-16; ComponentStatus: Released; PLMStatus: Active; Second Source allowed: Yes; Voltage DC (max): na; Symbol Type: Quad R/S latch with 3-state outputs; Alternate View: No; Part Type: Integrated Circuit; Manufacturer Order Number: HEF4043BT,653; Value: HEF4043BT,653; Type: Digital; Temperature min: -40; Temperature max: 85; Temperature Range: Industrial; ROHS Compliant: Y; Automotive Qualified: No; PackageReference: SO-16; ComponentLink1Description: Vendor WebSite; ComponentLink1URL: http://www.nexperia.com; ComponentLink2Description: Datasheet; ComponentLink2URL: http://webnetprod.muc.infineon.com/PCBPortal_Prod/WorkFlows/AltiumComponent/StandardDocumentation?Versionid=648080; Supplier 1: Farnell; Supplier 2: DigiKey; Supplier Part Number 2: 1727-1799-1-ND; Supplier 3: Mouser; Supplier Part Number 3: 771-HEF4043BT653; Package Description: SOIC,1.27mm pitch;16 pin,3.90mm W X 9.90mm L X 1.75mm H body; MPN: HEF4043BT,653

## Sheet Miscellaneous.SchDoc: <Project Name>
size A3; ApprovedBy: <Appr.>; Author: <Author>; CompanyName: Infineon Technologies AG; Engineer: <Rel.>; Organization: Infineon Technologies AG; Address1: IFAG DES S PS; Address2: Am Campeon 1-12  -  85579 Neubiberg  -  Germany; Address3: 85579 Neubiberg; Address4: Germany; DocumentNumber: 9; Revision: <Rev.>; SheetNumber: 9; SheetTotal: 9; Release: RC00; PageSetup: Record=PageOptions|CenterHorizontal=True|CenterVertical=True|PrintScale=1.01|XCorrection=1.00|YCorrection=1.00|PrintKind=0|BorderSize=5000000|LeftOffset=0|BottomOffset=0|Orientation=2|PaperLength=1000|PaperWidth=1000|Scale=100|PaperSource=7|PrintQuality=-4|MediaType=1|DitherType=10|PaperKind=A3|PrintScaleMode=1; Doc_ConfidentialStatus: <Doc_ConfidentialStatus>; Doc_Preliminary: <Doc_Preliminary>
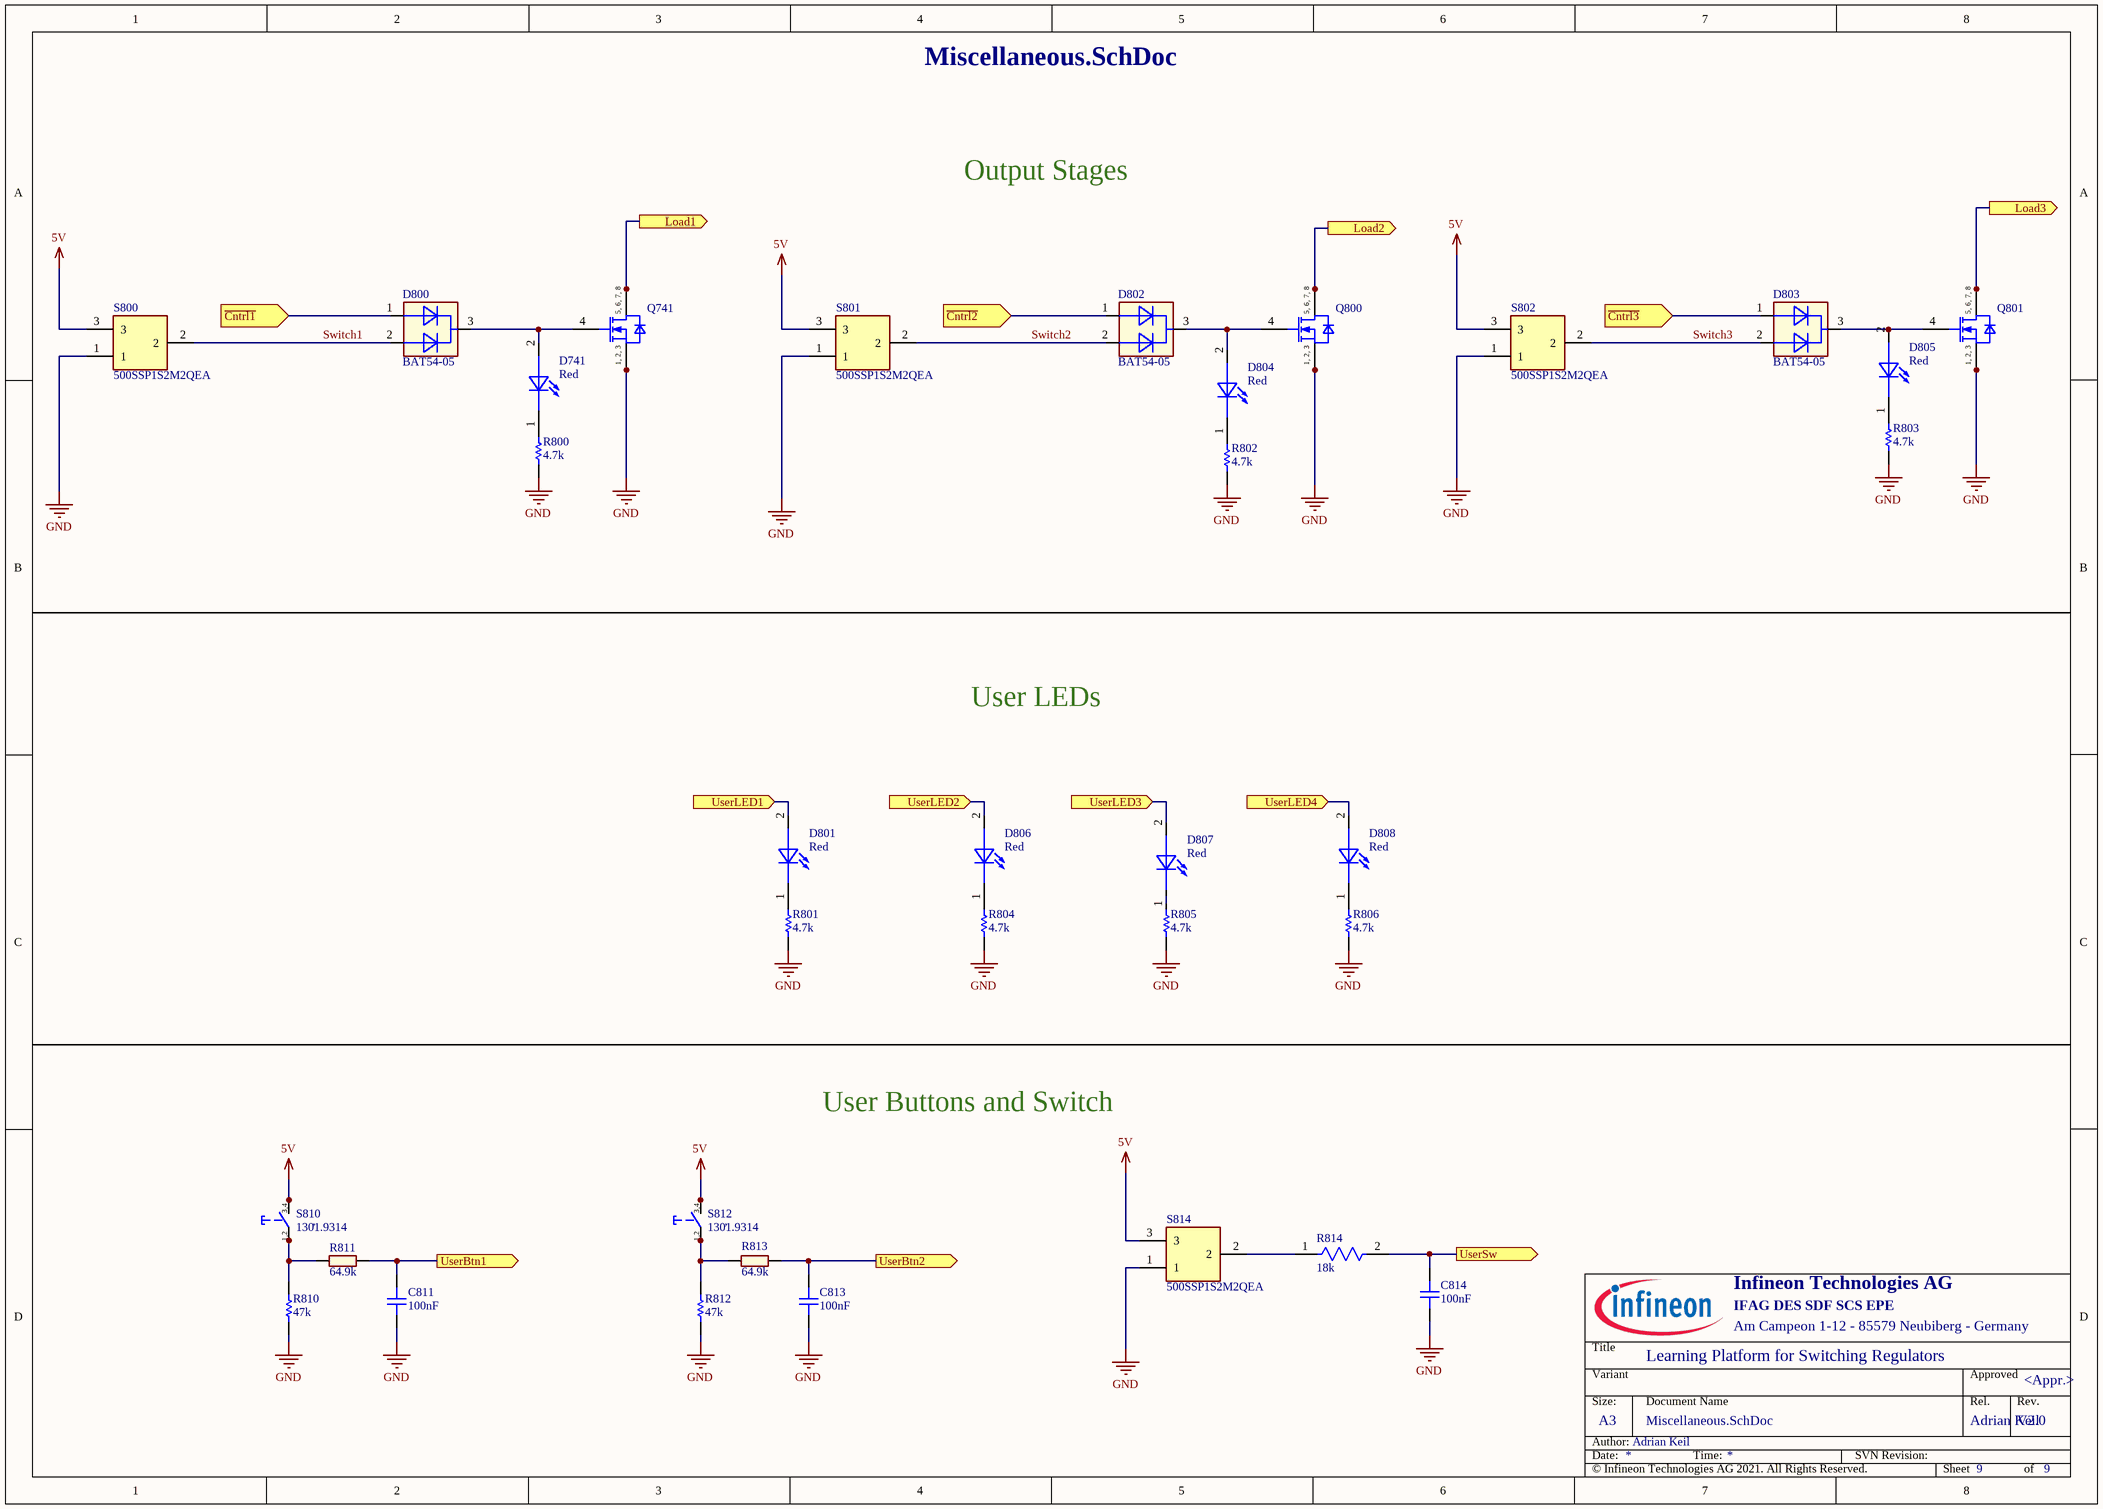
[diagram p5: Miscellaneous.SchDoc]

### Parts
C811  100nF  [CAPC3216X125N-0]
C813  100nF  [CAPC3216X125N-0]
C814  100nF  [CAPC3216X125N-0]
D741  Red  [LEDSC160X80X80-2N-1]
D800  BAT54-05  [SOT95P240X110-3N-1-V]
D801  Red  [LEDSC160X80X80-2N-1]
D802  BAT54-05  [SOT95P240X110-3N-1-V]
D803  BAT54-05  [SOT95P240X110-3N-1-V]
D804  Red  [LEDSC160X80X80-2N-1]
D805  Red  [LEDSC160X80X80-2N-1]
D806  Red  [LEDSC160X80X80-2N-1]
D807  Red  [LEDSC160X80X80-2N-1]
D808  Red  [LEDSC160X80X80-2N-1]
Q741  igfet_n_ch_enh_dio_1s2s3s4g5d6d7d8d_8p  [IFX-PG-TDSON-8-6-V]  (value not drawn)
Q800  igfet_n_ch_enh_dio_1s2s3s4g5d6d7d8d_8p  [IFX-PG-TDSON-8-6-V]  (value not drawn)
Q801  igfet_n_ch_enh_dio_1s2s3s4g5d6d7d8d_8p  [IFX-PG-TDSON-8-6-V]  (value not drawn)
R800  4.7k  [RESC3216X60X45ML15T20]
R801  4.7k  [RESC3216X60X45ML15T20]
R802  4.7k  [RESC3216X60X45ML15T20]
R803  4.7k  [RESC3216X60X45ML15T20]
R804  4.7k  [RESC3216X60X45ML15T20]
R805  4.7k  [RESC3216X60X45ML15T20]
R806  4.7k  [RESC3216X60X45ML15T20]
R810  47k  [RESC3216X60X45LL10T20]
R811  64.9k  [RESC3216X60N]
R812  47k  [RESC3216X60X45LL10T20]
R813  64.9k  [RESC3216X60N]
R814  18k  [FP-CRCW1206-e3-IPC_C]
S800  500SSP1S2M2QEA  [500SSP1S2M2QEA]
S801  500SSP1S2M2QEA  [500SSP1S2M2QEA]
S802  500SSP1S2M2QEA  [500SSP1S2M2QEA]
S810  1301.9314  [SW-SMD-1301.9314]
S812  1301.9314  [SW-SMD-1301.9314]
S814  500SSP1S2M2QEA  [500SSP1S2M2QEA]

### Ports
Load1 (out), Load2 (out), Load3 (out), UserBtn1 (out), UserBtn2 (out), UserLED1 (in), UserLED2 (in), UserLED3 (in), UserLED4 (in), UserSw (out), ~{Cntrl1} (in), ~{Cntrl2} (in), ~{Cntrl3} (in)

### Nets
5V: S800.3 S801.3 S802.3 S810.3 S810.4 S812.3 S812.4 S814.3
GND: C811.1 C813.1 C814.1 Q741.1(SOURCE) Q741.2(SOURCE) Q741.3(SOURCE) Q800.1(SOURCE) Q800.2(SOURCE) Q800.3(SOURCE) Q801.1(SOURCE) Q801.2(SOURCE) Q801.3(SOURCE) R800.1 R801.1 R802.1 R803.1 R804.1 R805.1 R806.1 R810.1 R812.1 S800.1 S801.1 S802.1 S814.1
~{Cntrl1}: D800.1(ANODE_1) ; port ~{Cntrl1}
~{Cntrl2}: D802.1(ANODE_1) ; port ~{Cntrl2}
~{Cntrl3}: D803.1(ANODE_1) ; port ~{Cntrl3}
Load1: Q741.5(DRAIN) Q741.6(DRAIN) Q741.7(DRAIN) Q741.8(DRAIN) ; port Load1
Load2: Q800.5(DRAIN) Q800.6(DRAIN) Q800.7(DRAIN) Q800.8(DRAIN) ; port Load2
Load3: Q801.5(DRAIN) Q801.6(DRAIN) Q801.7(DRAIN) Q801.8(DRAIN) ; port Load3
Switch1: D800.2(ANODE_2) S800.2
Switch2: D802.2(ANODE_2) S801.2
Switch3: D803.2(ANODE_2) S802.2
UserBtn1: C811.2 R811.2 ; port UserBtn1
UserBtn2: C813.2 R813.2 ; port UserBtn2
UserLED1: D801.2(Anode) ; port UserLED1
UserLED2: D806.2(Anode) ; port UserLED2
UserLED3: D807.2(Anode) ; port UserLED3
UserLED4: D808.2(Anode) ; port UserLED4
UserSw: C814.2 R814.2 ; port UserSw
NetD741_1: D741.1(Cathode) R800.2
NetD741_2: D741.2(Anode) D800.3(CATHODE) Q741.4(GATE)
NetD801_1: D801.1(Cathode) R801.2
NetD802_3: D802.3(CATHODE) D804.2(Anode) Q800.4(GATE)
NetD803_3: D803.3(CATHODE) D805.2(Anode) Q801.4(GATE)
NetD804_1: D804.1(Cathode) R802.2
NetD805_1: D805.1(Cathode) R803.2
NetD806_1: D806.1(Cathode) R804.2
NetD807_1: D807.1(Cathode) R805.2
NetD808_1: D808.1(Cathode) R806.2
NetR810_2: R810.2 R811.1 S810.1 S810.2
NetR812_2: R812.2 R813.1 S812.1 S812.2
NetR814_1: R814.1 S814.2

### Notes on the sheet
- Output Stages
- User LEDs
- User Buttons and Switch
- ,
- Title
- Variant
- Approved
- Date:
- Author:
- Size:
- A3
- Document Name
- Time:
- SVN Revision:
- Rel.
- Rev.
- Sheet
- of
- (in symbol 380147) 3,4; 1,2
- (in symbol 691273) 5, 6, 7, 8; 1, 2, 3

### Library data of the parts
C811 C813 C814 = 282874: as C500 on sheet Safety; Legacy DeviceID: CAP01005660; Part Type: Capacitor; Value: 100nF; Tolerance Neg: 10%; Tolerance Pos: 10%; Application: Standard; Technology: Ceramic; Temperature min: -55; Temperature max: 125; Temperature Range: Military; ROHS Compliant: Y; Automotive Qualified: No; PackageReference: 1206 (3216); ComponentLink1Description: Vendor WebSite; ComponentLink1URL: http://www.murata.com/; ComponentLink2Description: Datasheet; ComponentLink2URL: http://webnetprod.muc.infineon.com/PCBPortal_Prod/WorkFlows/AltiumComponent/StandardDocumentation?Versionid=282875; Supplier 1: Farnell; Supplier 2: DigiKey; Supplier 3: Mouser; Second Source allowed: Yes; Voltage DC (max): 50V; Package Description: Capacitor,non-polarized,Chip;3.20mm L X 1.60mm W X 1.25mm H
D741 D801 D804-D808 = 625459: as D502-D504 on sheet Safety; Part Type: Diode; Value: Red; Type: LED; Application: Standard; Temperature min: -40; Temperature max: 85; Temperature Range: Industrial; ROHS Compliant: Y; PackageReference: 1608 (0603); ComponentLink1Description: Vendor WebSite; ComponentLink1URL: http://www.we-online.com; ComponentLink2Description: Datasheet; ComponentLink2URL: http://webnetprod.muc.infineon.com/PCBPortal_Prod/WorkFlows/AltiumComponent/StandardDocumentation?Versionid=625460; Supplier 1: Farnell; Supplier Part Number 1: 2322071; Supplier 2: DigiKey; Supplier Part Number 2: 732-4978-1-ND; Supplier 3: Mouser; Supplier Part Number 3: 710-150060RS75000; Package Description: LED,Side Concave; 2 pin,1.60mm W X 0.80mm L X 0.80mm H
D800 D802 D803 = 430837: as D520 on sheet Safety; Legacy DeviceID: IFX01401370; Part Type: Diode; Manufacturer Order Number: BAT54-05; Value: BAT54-05; Type: Schottky Diode; Application: Standard; Temperature min: 0; Temperature max: 150; Temperature Range: Military; ROHS Compliant: Y; PackageReference: PG-SOT23-3-11; ComponentLink1Description: Vendor WebSite; ComponentLink1URL: https://www.infineon.com/; ComponentLink2Description: Datasheet; ComponentLink2URL: http://webnetprod.muc.infineon.com/PCBPortal_Prod/WorkFlows/AltiumComponent/StandardDocumentation?Versionid=430838; Supplier 1: Farnell; Supplier Part Number 1: 2725759; Supplier 2: DigiKey; Supplier Part Number 2: BAT5405E6327HTSA1TR-ND; Supplier 3: Mouser; Supplier Part Number 3: 726-BAT5405E6327HTSA; Package Description: SOT,0.95mm pitch;3 pin,1.30mm W X 2.90mm L X 1.10mm H body
Q741 = 691273: OptiMOS Power MOSFET, 30V; Manufacturer: Infineon Technologies; Manufacturer Order Number: BSC0906NS; MPN: BSC0906NSATMA1; Symbol Type: Insulated-Gate Field-Effect Transistor (IGFET), N-Channel, Enhancement, Body Diode, Pin 1 Source, 2 Source, 3 Source, 4 Gate, 5 Drain, 6 Drain, 7 Drain, 8 Drain, 8 Pins; Article Number: 691273; Version Number: V00; Legacy DeviceID: IFX_BSC0906NS; Value: BSC0906NS; Combined Parameters: N-Channel Enhancement;Uds:30V;Id:63A;Rds:4.5R;P:30W; QuickPick: N-Channel Enhancement / 30W / 63A / 30V / TDSON-8; Type: N-Channel Enhancement; Style: Single; Automotive Qualified: No; ComponentStatus: Released; PLMStatus: Active; Second Source allowed: Yes; Voltage DC (max): na; Part Type: Transistor FET; Application: Power Electronics; Temperature min: -55; Temperature max: 150; Temperature Range: Military; ROHS Compliant: Y; PackageReference: TDSON-8; ComponentLink1Description: Vendor WebSite; ComponentLink1URL: https://www.infineon.com/; ComponentLink2Description: Datasheet; ComponentLink2URL: http://webnetprod.muc.infineon.com/PCBPortal_Prod/WorkFlows/AltiumComponent/StandardDocumentation?Versionid=691274; Supplier 1: Farnell; Supplier Part Number 1: 2480745; Supplier 2: DigiKey; Supplier Part Number 2: BSC0906NSATMA1CT-ND; Supplier 3: Mouser; Supplier Part Number 3: 726-BSC0906NS; Package Description: PG-TDSON-8-6, SMD, 1.27 mm pitch, 8 pin, 5.90 mm W X 5.075 mm L X 1.20 mm H body
Q800 Q801 = 691273: OptiMOS Power MOSFET, 30V; Manufacturer: Infineon Technologies; Manufacturer Order Number: BSC0906NS; Symbol Type: Insulated-Gate Field-Effect Transistor (IGFET), N-Channel, Enhancement, Body Diode, Pin 1 Source, 2 Source, 3 Source, 4 Gate, 5 Drain, 6 Drain, 7 Drain, 8 Drain, 8 Pins; Article Number: 691273; Version Number: V00; Legacy DeviceID: IFX_BSC0906NS; Value: BSC0906NS; Combined Parameters: N-Channel Enhancement;Uds:30V;Id:63A;Rds:4.5R;P:30W; QuickPick: N-Channel Enhancement / 30W / 63A / 30V / TDSON-8; Type: N-Channel Enhancement; Style: Single; Automotive Qualified: No; ComponentStatus: Released; PLMStatus: Active; Second Source allowed: Yes; Voltage DC (max): na; Part Type: Transistor FET; Application: Power Electronics; Temperature min: -55; Temperature max: 150; Temperature Range: Military; ROHS Compliant: Y; PackageReference: TDSON-8; ComponentLink1Description: Vendor WebSite; ComponentLink1URL: https://www.infineon.com/; ComponentLink2Description: Datasheet; ComponentLink2URL: http://webnetprod.muc.infineon.com/PCBPortal_Prod/WorkFlows/AltiumComponent/StandardDocumentation?Versionid=691274; Supplier 1: Farnell; Supplier Part Number 1: 2480745; Supplier 2: DigiKey; Supplier Part Number 2: BSC0906NSATMA1CT-ND; Supplier 3: Mouser; Supplier Part Number 3: 726-BSC0906NS; Package Description: PG-TDSON-8-6, SMD, 1.27 mm pitch, 8 pin, 5.90 mm W X 5.075 mm L X 1.20 mm H body
R800-R806 = CMP-2100-03618-1: as R551-R554 on sheet Safety; Package Quantity: 10; Composition: ThickFilm; REACH SVHC: Unknown; Mount: SurfaceMount; Max Operating Temperature: 155degC; Length: 3.2mm; Number of Terminations: 2; Case Code (Metric): 3216; Military Standard: Not; Width: 1.6mm; Datasheet Version: 41061.0; Max Power Dissipation: 250mW; Datasheet URL: http://www.vishay.com/docs/20035/dcrcwe3.pdf; Contact Plating: Tin; Case/Package: 1206; Height: 0.55mm; Package Reference: 1206.0; Lead Free: LeadFree; Weight: 0.000353oz; Package Description: 2-Pin Surface Mount Device, Body 3.15 x 1.6 mm; Min Operating Temperature: -55degC; Value: 4.7KOhm; Packaging: TapeandReel; Depth: 1.6mm; Tolerance: 1%; RoHSCompliant: true; Termination: SMD/SMT; Case Code (Imperial): 1206; Voltage Rating (DC): 200V; Radiation Hardening: No; Manufacturer URL: http://www.vishay.com/
R810 R812 = CMP-2003-02213-1: as R503 on sheet Safety; Value: 47k
R811 R813 = 354647: as R505 on sheet Safety; Legacy DeviceID: RES01802950; Part Type: Resistor; Value: 64.9k; Tolerance Neg: 1%; Tolerance Pos: 1%; Type: Standard; Technology: Thick Film; Temperature min: -55; Temperature max: 155; Temperature Range: Military; ROHS Compliant: Y; PackageReference: 1206 (3216); ComponentLink1Description: Vendor WebSite; ComponentLink1URL: http://www.vishay.com; ComponentLink2Description: Datasheet; ComponentLink2URL: http://webnetprod.muc.infineon.com/PCBPortal_Prod/WorkFlows/AltiumComponent/StandardDocumentation?Versionid=354648; Supplier 1: Farnell; Supplier 2: DigiKey; Supplier 3: Mouser; Second Source allowed: Yes
R814 = CMP-2003-01854-2: as R511 on sheet Safety; Radiation Hardening: No; Case Code (Imperial): 1206; Case/Package: 1206; Lead Free: Lead Free; Number of Terminations: 2; Case Code (Metric): 3216; Number of Pins: 2; Power Rating: 250mW; Length: 3.2mm; Width: 0.063inch; Features: Automotive AEC-Q200; Max Operating Temperature: 155°C; Tolerance: 1%; Termination: SMD/SMT; Military Standard: Not; Composition: Thick Film; Min Operating Temperature: -55°C; Temperature Coefficient: 100ppm/°C; Package Quantity: 10; Weight: 0.000353oz; Voltage Rating (DC): 200V; Depth: 1.6mm; Contact Plating: Tin; Height: 0.55mm; Packaging: Tape and Reel; Value: 18k
S800-S802 S814 = 500SSP1S2M2QEA: Connector; Manufacturer_Name: E-Switch; Datasheet Link: https://configured-product-images.s3.amazonaws.com/2D/specs/500SSP1S2M2QEA.pdf; Height: 6.6mm; Manufacturer_Part_Number: 500SSP1S2M2QEA; Mouser Part Number: 612-500SSP1S2M2QEA; Mouser Price/Stock: https://www.mouser.co.uk/ProductDetail/E-Switch/500SSP1S2M2QEA?qs=f57gQzlyLipU%252BL4xPBemOw%3D%3D; Value: 500SSP1S2M2QEA
S810 S812 = 380147: as S560 on sheet Safety; Part Type: Electro Mechanic; Manufacturer Order Number: 1301.9314; Value: 1301.9314; Temperature min: -20; Temperature max: 70; Temperature Range: Commercial; ROHS Compliant: Y; ComponentLink1Description: Vendor WebSite; ComponentLink1URL: http://www.schurter.com.sg/; ComponentLink2Description: Datasheet; ComponentLink2URL: http://webnetprod.muc.infineon.com/PCBPortal_Prod/WorkFlows/AltiumComponent/StandardDocumentation?Versionid=380148; Supplier 1: Farnell; Supplier Part Number 1: 1217763; Supplier 2: DigiKey; Supplier Part Number 2: 1301.9314-ND; Supplier 3: Mouser; Supplier Part Number 3: 693-1301.9314; Package Description: SMD Switch, 6.00mm L X 6.00mm W X 4.3mm H body

## Nets that join several sheets
5V: 02_Top_Level (D112.2 R160.3), Input (R636.2), PowerStage (5 pins), PowerSupply (C332.1 G330.3 G330.4 TP320.1), Safety (21 pins), Miscellaneous (8 pins)
GND: 02_Top_Level (19 pins), Input (17 pins), PowerStage (22 pins), PowerSupply (9 pins), Safety (21 pins), Miscellaneous (25 pins)
~{Cntrl1}: 02_Top_Level (R100.1 X110.1D), Miscellaneous (D800.1)
~{Cntrl2}: 02_Top_Level (R101.1 X110.2D), Miscellaneous (D802.1)
~{Cntrl3}: 02_Top_Level (R102.1 X110.3D), Miscellaneous (D803.1)
~{Shutdown}: 02_Top_Level (R112.1), PowerStage (Q402.1), Safety (9 pins)
Buck_Cntrl: 02_Top_Level (S122.2), PowerStage (TP400.1 U400.5)
Inductor_Current: 02_Top_Level (X110.2B X140.2), PowerStage (R610.2 TP600.1), Safety (R506.1)
Input_Current: 02_Top_Level (X110.1B X140.1), Input (R635.2 TP630.1)
Load1: 02_Top_Level (190.3 190.4), Miscellaneous (Q741.5 Q741.6 Q741.7 Q741.8)
Load2: 02_Top_Level (190.5 190.6), Miscellaneous (Q800.5 Q800.6 Q800.7 Q800.8)
Load3: 02_Top_Level (190.7 190.8), Miscellaneous (Q801.5 Q801.6 Q801.7 Q801.8)
NetQ200_2: 02_Top_Level (X100.1 X100.2), Input (Q200.2)
NTC_ext: 02_Top_Level (190.9 X110.6B), Safety (C533.2 R532.1 TP532.1 U520.8)
UserBtn1: 02_Top_Level (X110.4D), Miscellaneous (C811.2 R811.2)
UserBtn2: 02_Top_Level (X110.5D), Miscellaneous (C813.2 R813.2)
UserLED1: 02_Top_Level (X110.2C), Miscellaneous (D801.2)
UserLED2: 02_Top_Level (X110.3C), Miscellaneous (D806.2)
UserLED3: 02_Top_Level (X110.4C), Miscellaneous (D807.2)
UserLED4: 02_Top_Level (X110.5C), Miscellaneous (D808.2)
UserSw: 02_Top_Level (X110.6C), Miscellaneous (C814.2 R814.2)
Vin: Input (7 pins), PowerStage (6 pins), PowerSupply (C320.2 C321.2 G320.3 G320.5), Safety (R510.2)
Vin_Meas: 02_Top_Level (X110.4B), Input (C221.2 R220.1 R221.2)
Vout: 02_Top_Level (190.1 190.2), PowerStage (9 pins)
Vout_Meas: 02_Top_Level (X110.5B X140.5), PowerStage (R721.1 R722.2)

## Assembly variants
Default_Assembly: not fitted C521 MP100 MP101 MP102 MP103
OnlySMD: not fitted C521 MP100 MP101 MP102 MP103 TP100 TP101 TP102 TP103 TP104 TP105 X100 X101 X110 X150